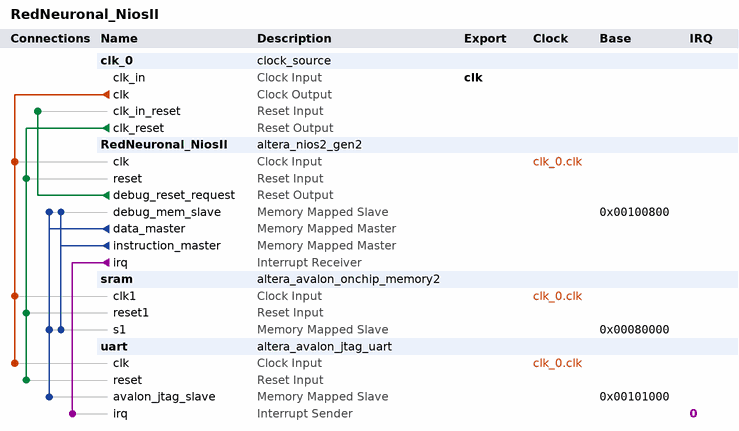
[diagram p0: system contents]
# Platform Designer (Qsys) system RedNeuronal_NiosII, Cyclone V 5CSXFC6D6F31C6
# Parameters at their usual value, and those the tool derives, are not listed.
package require -exact qsys 18.1
create_system RedNeuronal_NiosII
set_project_property DEVICE_FAMILY {Cyclone V}
set_project_property DEVICE 5CSXFC6D6F31C6

add_instance clk_0 clock_source 18.1
set_instance_parameter_value clk_0 clockFrequency 50000000

add_instance RedNeuronal_NiosII altera_nios2_gen2 18.1
set_instance_parameter_value RedNeuronal_NiosII dcache_size 2048
set_instance_parameter_value RedNeuronal_NiosII exceptionSlave sram.s1
set_instance_parameter_value RedNeuronal_NiosII icache_size 4096
set_instance_parameter_value RedNeuronal_NiosII impl Tiny
set_instance_parameter_value RedNeuronal_NiosII resetSlave sram.s1

add_instance sram altera_avalon_onchip_memory2 18.1
set_instance_parameter_value sram dataWidth 32
set_instance_parameter_value sram dualPort false
set_instance_parameter_value sram initMemContent true
set_instance_parameter_value sram initializationFileName onchip_mem.hex
set_instance_parameter_value sram memorySize 409600

add_instance uart altera_avalon_jtag_uart 18.1
set_instance_parameter_value uart simInteractiveOptions NO_INTERACTIVE_WINDOWS

# connections
add_connection clk_0.clk RedNeuronal_NiosII.clk clock
add_connection clk_0.clk sram.clk1 clock
add_connection clk_0.clk uart.clk clock
add_connection clk_0.clk_reset RedNeuronal_NiosII.reset reset
add_connection clk_0.clk_reset sram.reset1 reset
add_connection clk_0.clk_reset uart.reset reset
add_connection RedNeuronal_NiosII.debug_reset_request clk_0.clk_in_reset reset
add_connection RedNeuronal_NiosII.data_master RedNeuronal_NiosII.debug_mem_slave avalon
set_connection_parameter_value RedNeuronal_NiosII.data_master/RedNeuronal_NiosII.debug_mem_slave baseAddress 0x00100800
add_connection RedNeuronal_NiosII.data_master sram.s1 avalon
set_connection_parameter_value RedNeuronal_NiosII.data_master/sram.s1 baseAddress 0x00080000
add_connection RedNeuronal_NiosII.data_master uart.avalon_jtag_slave avalon
set_connection_parameter_value RedNeuronal_NiosII.data_master/uart.avalon_jtag_slave baseAddress 0x00101000
add_connection RedNeuronal_NiosII.instruction_master RedNeuronal_NiosII.debug_mem_slave avalon
set_connection_parameter_value RedNeuronal_NiosII.instruction_master/RedNeuronal_NiosII.debug_mem_slave baseAddress 0x00100800
add_connection RedNeuronal_NiosII.instruction_master sram.s1 avalon
set_connection_parameter_value RedNeuronal_NiosII.instruction_master/sram.s1 baseAddress 0x00080000
add_connection RedNeuronal_NiosII.irq uart.irq interrupt
set_connection_parameter_value RedNeuronal_NiosII.irq/uart.irq irqNumber 0

# exported interfaces
add_interface clk clock sink
set_interface_property clk EXPORT_OF clk_0.clk_in

set_interconnect_requirement {$system} qsys_mm.clockCrossingAdapter HANDSHAKE
set_interconnect_requirement {$system} qsys_mm.enableEccProtection FALSE
set_interconnect_requirement {$system} qsys_mm.insertDefaultSlave FALSE
set_interconnect_requirement {$system} qsys_mm.maxAdditionalLatency 1

save_system RedNeuronal_NiosII.qsys
